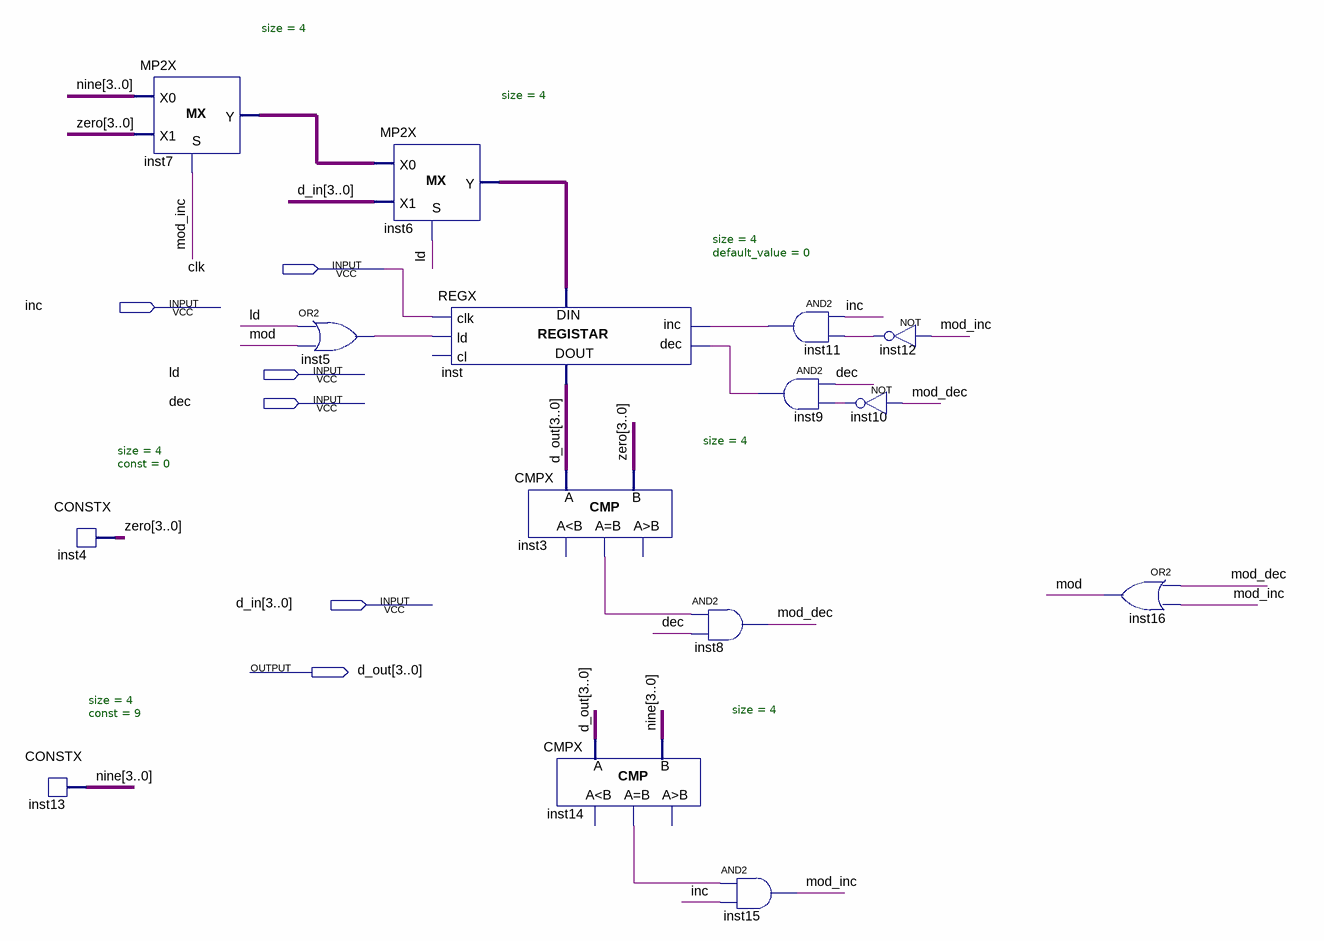
[diagram p0: schematic sheet]
// Quartus schematic RegMod9Dec.bdf as structural Verilog: 15 symbols, 6 pins
module RegMod9Dec (
  input  clk,
  input  inc,
  input  ld,
  input  dec,
  input  [3:0] d_in,
  output [3:0] d_out
);

  wire inst3_eq, inst5_out, inst9_out, inst10_out, inst11_out, inst12_out, inst14_eq, mod, mod_dec, mod_inc;
  wire [3:0] inst6_y, inst7_y, nine, zero;

  CONSTX #(.size(4), .\const (9)) inst13 (.data(nine));
  CONSTX #(.size(4), .\const (0)) inst4 (.data(zero));
  MP2X #(.size(4)) inst7 (.S(mod_inc), .X0(nine), .X1(zero), .Y(inst7_y));
  or inst5 (inst5_out, ld, mod);
  MP2X #(.size(4)) inst6 (.S(ld), .X0(inst7_y), .X1(d_in), .Y(inst6_y));
  REGX #(.size(4), .default_value(0)) inst (
    .clk(clk), .ld(inst5_out), .inc(inst11_out), .dec(inst9_out), .data_in(inst6_y), .data_out(d_out));  // open: cl
  CMPX #(.size(4)) inst3 (.A(d_out), .B(zero), .eq(inst3_eq));  // open: ls, gr
  CMPX #(.size(4)) inst14 (.A(d_out), .B(nine), .eq(inst14_eq));  // open: ls, gr
  and inst8 (mod_dec, inst3_eq, dec);
  and inst11 (inst11_out, inc, inst12_out);
  and inst9 (inst9_out, dec, inst10_out);
  and inst15 (mod_inc, inst14_eq, inc);
  not inst10 (inst10_out, mod_dec);
  not inst12 (inst12_out, mod_inc);
  or inst16 (mod, mod_dec, mod_inc);
endmodule
